# Altium schematic sheet USB_USBA.SchDoc: USBA
size A3; Author: Silvio Navaretti; CompanyName: ARDUINO; DrawnBy: Silvio Navaretti; Engineer: Silvio Navaretti; Organization: ARDUINO; SheetNumber: 34; SheetTotal: 51; RevAuthor: Silvio Navaretti
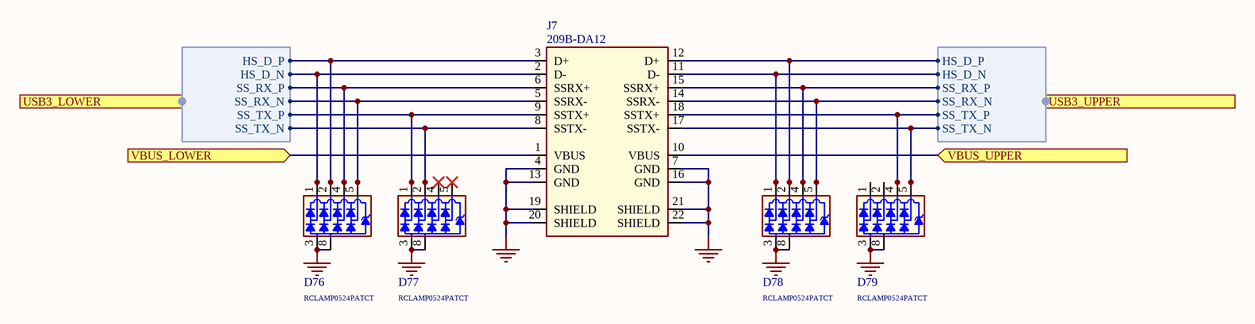
[diagram p0: USB_USBA.SchDoc]

## Parts
D76  RCLAMP0524PATCT  [SLP2510P8]
D77  RCLAMP0524PATCT  [SLP2510P8]
D78  RCLAMP0524PATCT  [SLP2510P8]
D79  RCLAMP0524PATCT  [SLP2510P8]
J7  209B-DA12  [209B-DA12]

## Ports
USB3_LOWER (harness SOM_MD_USB0), USB3_UPPER (harness SOM_MD_USB0), VBUS_LOWER (in), VBUS_UPPER (in)

## Harnesses
SOM_MD_USB0: SS_TX_N, SS_TX_P, HS_D_P, HS_D_N, SS_RX_P, SS_RX_N

## Nets
GND: D76.3 D76.8 D77.3 D77.8 D78.3 D78.8 D79.3 D79.8 J7.4(GND) J7.7(GND) J7.13(GND) J7.16(GND) J7.19(SHIELD) J7.20(SHIELD) J7.21(SHIELD) J7.22(SHIELD)
VBUS_LOWER: J7.1(VBUS) ; port VBUS_LOWER
VBUS_UPPER: J7.10(VBUS) ; port VBUS_UPPER
NetD76_1: D76.1 D76.10 J7.2(D-) ; port USB3_LOWER.HS_D_N
NetD76_2: D76.2 D76.9 J7.3(D+) ; port USB3_LOWER.HS_D_P
NetD76_4: D76.4 D76.7 J7.6(SSRX+) ; port USB3_LOWER.SS_RX_P
NetD76_5: D76.5 D76.6 J7.5(SSRX-) ; port USB3_LOWER.SS_RX_N
NetD77_1: D77.1 D77.10 J7.9(SSTX+) ; port USB3_LOWER.SS_TX_P
NetD77_2: D77.2 D77.9 J7.8(SSTX-) ; port USB3_LOWER.SS_TX_N
NetD77_4: D77.4 D77.7
NetD77_5: D77.5 D77.6
NetD78_1: D78.1 D78.10 J7.11(D-) ; port USB3_UPPER.HS_D_N
NetD78_2: D78.2 D78.9 J7.12(D+) ; port USB3_UPPER.HS_D_P
NetD78_4: D78.4 D78.7 J7.15(SSRX+) ; port USB3_UPPER.SS_RX_P
NetD78_5: D78.5 D78.6 J7.14(SSRX-) ; port USB3_UPPER.SS_RX_N
NetD79_1: D79.1 D79.10
NetD79_2: D79.2 D79.9
NetD79_4: D79.4 D79.7 J7.18(SSTX+) ; port USB3_UPPER.SS_TX_P
NetD79_5: D79.5 D79.6 J7.17(SSTX-) ; port USB3_UPPER.SS_TX_N

## Notes on the sheet
- Title:
- ID:
- Date:
- Time:
- Version:
- Sheet
- of
- RevAuthor:
- Reference Designs ARE PROVIDED "AS IS" AND "WITH ALL FAULTS. Arduino SA DISCLAIMS ALL OTHER WARRANTIES, EXPRESS OR IMPLIED, REGARDING PRODUCTS, INCLUDING BUT NOT LIMITED TO, ANY IMPLIED WARRANTIES OF MERCHANTABILITY OR FITNESS FOR A PARTICULAR PURPOSE.
  Arduino SA may make changes to specifications and product descriptions at any time, without notice. The Customer must not rely on the absence or characteristics of any features or instructions marked "reserved" or "undefined".
  Arduino SA reserves these for future definition and shall have no responsibility whatsoever for conflicts or incompatibilities arising from future changes to them. The product information on the Web Site or Materials is subject to change without notice.
  Do not finalize a design with this info. ARDUINO and other Arduino brands and logos and Trademarks of Arduino SA. All Arduino SA Trademarks cannot be used without owner's formal permission.
- File:
- Author:

## Library data of the parts
D76-D79 = D0097-A.6: TVS UNIDIRECTIONAL 4CH 0.8pF 5V SLP2510P8 10-pin 2.5x1.0x0.58mm; Manufacturer: SEMTECH; Code Arduino: D0097; Device Type: ESD protection; Part Number: RCLAMP0524PATCT
J7 = J0560-A.4: CONN TH USB-A x2 stacked USB3.0 tab blue; Manufacturer: ATTEND; Code Arduino: J0560; Part Number: 209B-DA12